# EAGLE design temp_sensor_ckt (EAGLE 9.6.2)
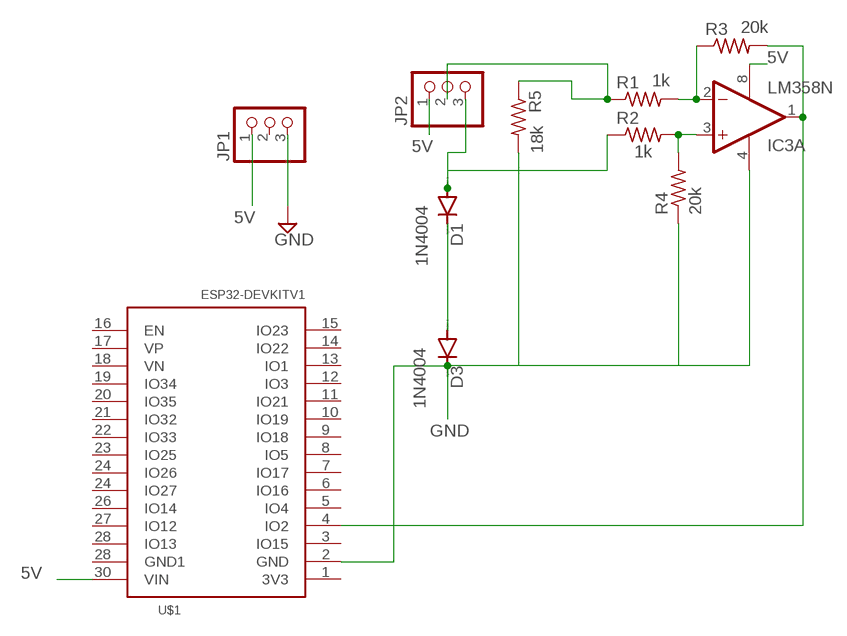
[diagram p0: schematic, sheet 1]

## Parts
D1  1N4004  [DO41-10]
D3  1N4004  [DO41-10]
IC3  LM358N  [DIL08]
JP1  PINHD-1X3  [1X03]
JP2  PINHD-1X3  [1X03]
R1  1k  R-US_0207/10  [0207/10]
R2  1k  R-US_0207/10  [0207/10]
R3  20k  R-US_0207/10  [0207/10]
R4  20k  R-US_0207/10  [0207/10]
R5  18k  R-US_0207/10  [0207/10]
U$1  ESP32DEVKITV1  [ESP32-DEVKITV1]

## Nets
5V: IC3.8(P:V+) JP1.1 JP2.1 U$1.30(VIN)
GND: D3.C IC3.4(P:V-) JP1.3 R4.1 R5.2 U$1.2(GND)
N$1: D1.A JP2.3 R2.1
N$2: D1.C D3.A
N$4: IC3.2(A:-IN) R1.2 R3.1
N$5: IC3.3(A:+IN) R2.2 R4.2
N$6: IC3.1(A:OUT) R3.2 U$1.4(IO2)
N$9: JP2.2 R1.1 R5.1
Unconnected: IC3.5(B:+IN) IC3.6(B:-IN) IC3.7(B:OUT) JP1.2 U$1.1(3V3) U$1.3(IO15) U$1.5(IO4) U$1.6(IO16) U$1.7(IO17) U$1.8(IO5) U$1.9(IO18) U$1.10(IO19) U$1.11(IO21) U$1.12(IO3) U$1.13(IO1) U$1.14(IO22) U$1.15(IO23) U$1.16(EN) U$1.17(VP) U$1.18(VN) U$1.19(IO34) U$1.20(IO35) U$1.21(IO32) U$1.22(IO33) U$1.23(IO25) U$1.24(IO26) U$1.24(IO27) U$1.26(IO14) U$1.27(IO12) U$1.28(GND1) U$1.28(IO13)

## Library data of the parts
D1 D3 = diode:1N4004: DIODE general purpose rectifier, 1 A
IC3 = linear:LM358: OP AMP also LM158; LM258; LM2904 Source: http://cache.national.com/ds/LM/LM158.pdf
JP1 JP2 = pinhead:PINHD-1X3: PIN HEADER
R1-R5 = rcl:R-US_: RESISTOR, American symbol; SPICEPREFIX: R
U$1 = ESP32-DEVKITV1:ESP32DEVKITV1

## Board
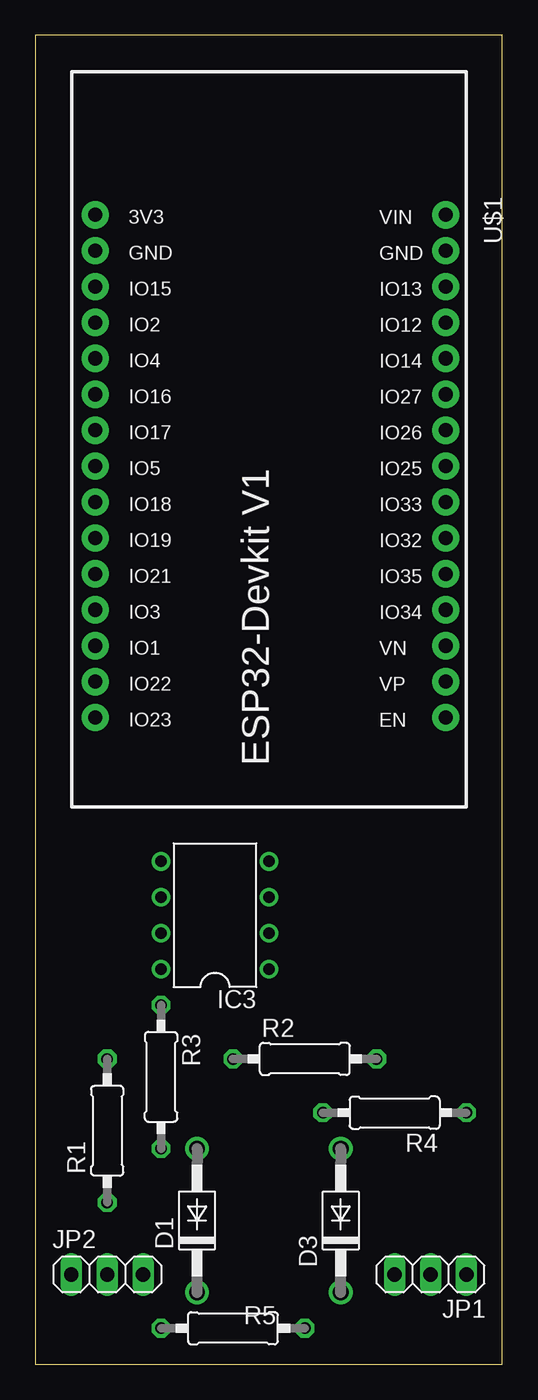
[diagram p1: board, top side]
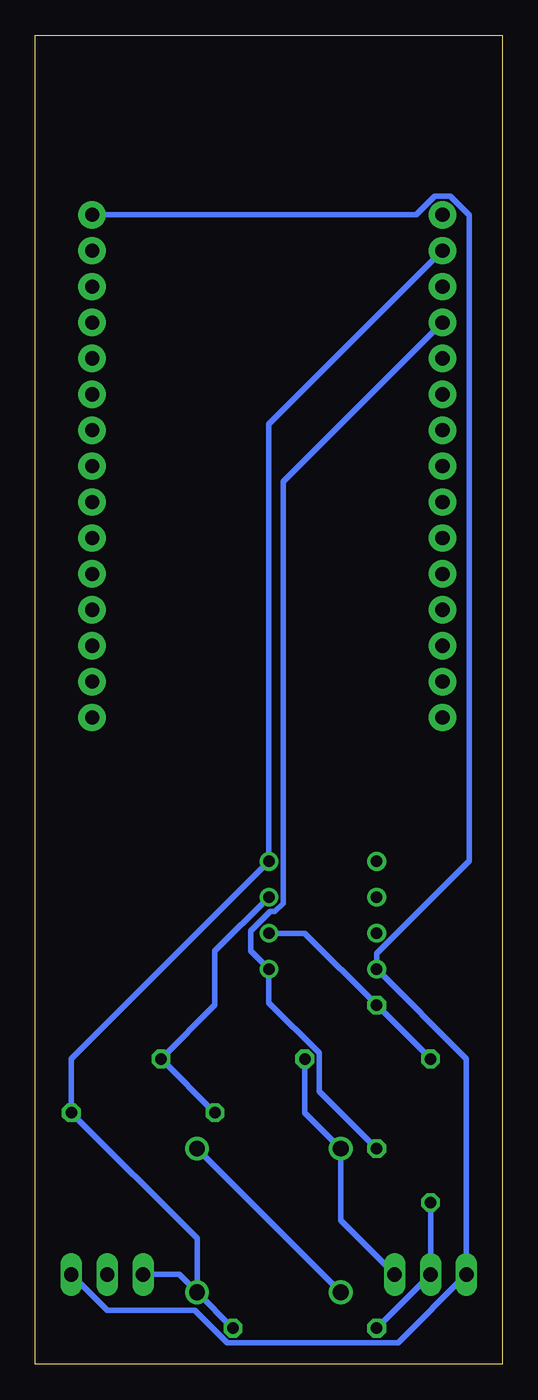
[diagram p2: board, bottom side, seen from below]

Size 33.02 x 93.98 mm. Coordinates in mm from the lower left corner, seen from the top.
Outline: 0,0 33.02,0 33.02,93.98 0,93.98 0,0
Copper layers (1*16): Top 0.035mm / dielectric 1.5mm / Bottom 0.035mm
Design rules "default": minimum track width 6mil, minimum drill 0.35mm, track to track 6mil, track to pad 6mil, pad to pad 6mil, via to via 6mil, smd to smd 6mil, copper to edge 40mil, drill to drill 6mil, minimum pad ring 10mil, minimum via ring 8mil, stop-mask expansion 4mil, vias tented up to drill 0mil, thermal gap 10mil

### Footprints (pad centres in the part's own frame; a part is rotated, then mirrored left to right if it is on the bottom)
DO41-10 = drill 1.118: A 5.08,0; C -5.08,0
DIL08 = drill 0.813 pad 1.27: 1 -3.81,-3.81; 2 -1.27,-3.81; 3 1.27,-3.81; 4 3.81,-3.81; 5 3.81,3.81; 6 1.27,3.81; 7 -1.27,3.81; 8 -3.81,3.81
1X03 = drill 1.016 long: 1 -2.54,0; 2 0,0; 3 2.54,0
0207/10 = drill 0.813 octagon: 1 -5.08,0; 2 5.08,0
ESP32-DEVKITV1 = drill 1 pad 1.93: 1 -22.87,-13.54; 2 -20.33,-13.54; 3 -17.79,-13.54; 4 -15.25,-13.54; 5 -12.71,-13.54; 6 -10.17,-13.54; 7 -7.63,-13.54; 8 -5.09,-13.54; 9 -2.55,-13.54; 10 -0.01,-13.54; 11 2.53,-13.54; 12 5.07,-13.54; 13 7.61,-13.54; 14 10.15,-13.54; 15 12.69,-13.54; 16 12.69,11.23; 17 10.15,11.23; 18 7.61,11.23; 19 5.07,11.23; 20 2.53,11.23; 21 -0.01,11.23; 22 -2.55,11.23; 23 -5.09,11.23; 24 -7.63,11.23; 25 -10.17,11.23; 26 -12.71,11.23; 27 -15.25,11.23; 28 -17.79,11.23; 29 -20.33,11.23; 30 -22.87,11.23

### Placement (x,y rotation side)
D1  11.43,10.16 90 top
D3  21.59,10.16 90 top
IC3  12.7,31.75 90 top
JP1  27.94,6.35 180 top
JP2  5.08,6.35 0 top
R1  5.08,16.51 90 top
R2  19.05,21.59 0 top
R3  8.89,20.32 270 top
R4  25.4,17.78 180 top
R5  13.97,2.54 0 top
U$1  17.78,58.42 270 top

### Tracks (layer width: path | path; a pad name or v marks a point on that pad's centre or on a via)
5V
  Bottom 0.406: U$1.30 6.11,81.29 4.79,82.61 3.69,82.61 2.36,81.28 2.36,35.57 8.89,29.04 IC3.8 2.54,21.59 JP2.1 7.37,1.52 19.47,1.52 21.76,3.81 27.94,3.81 JP1.1
GND
  Bottom 0.406: D3.C 21.59,8.89 R4.1 30.48,21.59 IC3.4 16.51,66.48 U$1.2 | D3.C 22.86,6.35 JP1.3 | R5.2 D3.C
N$1
  Bottom 0.406: JP2.3 11.43,10.16 D1.A 13.97,17.78 R2.1
N$2
  Bottom 0.406: D1.C D3.A
N$4
  Bottom 0.406: R1.2 R3.1 13.97,30.48 IC3.2
N$5
  Bottom 0.406: R4.2 R2.2 20.32,25.4 20.32,29.21 IC3.3
N$6
  Bottom 0.406: R3.2 12.95,19.3 12.95,22.01 16.51,25.57 IC3.1 17.78,29.21 17.78,30.65 16.42,32 16.09,32 15.49,32.6 15.49,62.42 U$1.4
N$9
  Bottom 0.406: R1.1 JP2.2 R5.1